# Altium schematic sheet PM3_Bosclone_PWR_0.SchDoc
size 282 x 200 mm
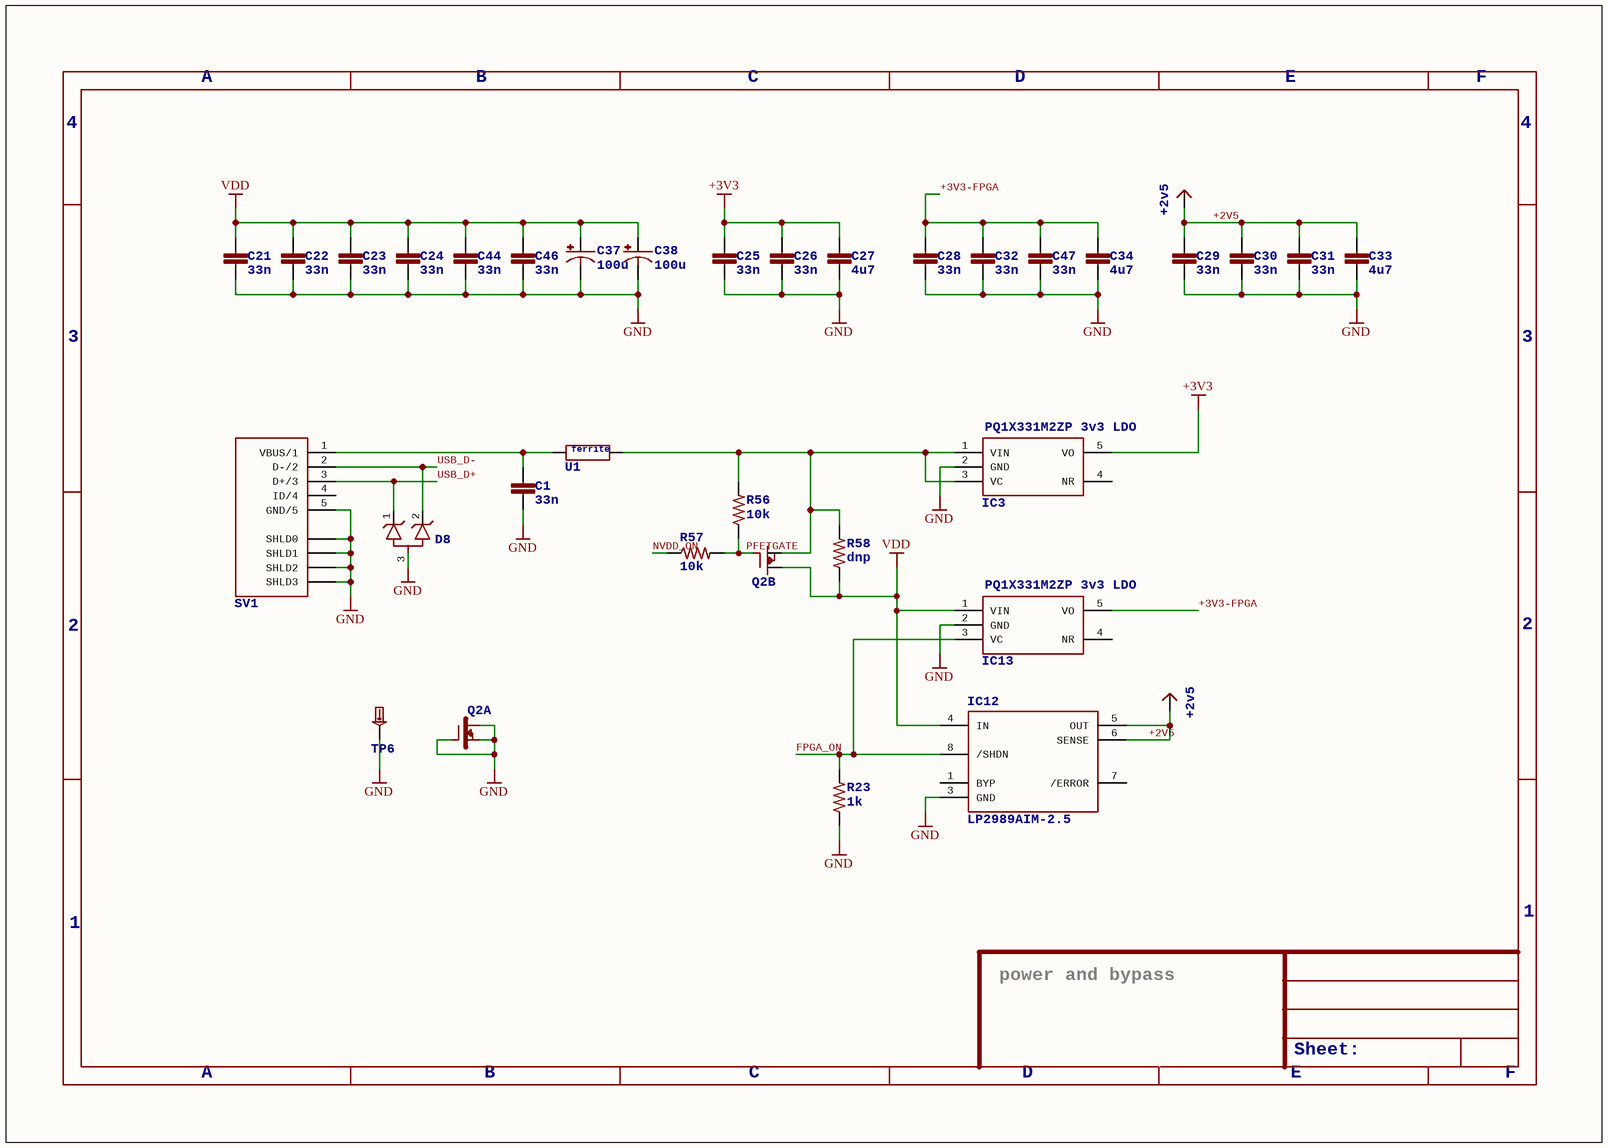
[diagram p0: PM3_Bosclone_PWR_0.SchDoc]

## Parts
C1  33n  [RLC_0603]
C21  33n  [RLC_0603]
C22  33n  [RLC_0603]
C23  33n  [RLC_0603]
C24  33n  [RLC_0603]
C25  33n  [RLC_0603]
C26  33n  [RLC_0603]
C27  4u7  [RLC_1210]
C28  33n  [RLC_0603]
C29  33n  [RLC_0603]
C30  33n  [RLC_0603]
C31  33n  [RLC_0603]
C32  33n  [RLC_0603]
C33  4u7  [RLC_1210]
C34  4u7  [RLC_1210]
C37  100u  [CAPCAITOR-ELECTROLYTIC-ALCHIP-MZA-F80]
C38  100u  [CAPCAITOR-ELECTROLYTIC-ALCHIP-MZA-F80]
C44  33n  [RLC_0603]
C46  33n  [RLC_0603]
C47  33n  [RLC_0603]
D8  DUAL-TVS-COMMON-ANODE  [SOT23-3LEAD]  (value not drawn)
IC3  PQ1X331M2ZP3v3LDO: PQ1X331M2ZP 3v3 LDO  [SOT-23-5]  (hidden comment: PQ1X331M2ZP-3V3-LDO-SOT-23-5)
IC12  LP2989AIM-2.5  [SOIC-8]
IC13  PQ1X331M2ZP3v3LDO: PQ1X331M2ZP 3v3 LDO  [SOT-23-5]  (hidden comment: PQ1X331M2ZP-3V3-LDO-SOT-23-5)
Q2  IRF7307  [SOIC-8]  (value not drawn)  (parts A,B of 2)
R23  1k  [RLC_0603]
R56  10k  [RLC_0603]
R57  10k  [RLC_0603]
R58  dnp  [RLC_0603]
SV1  USB-MINIB  [USB-MINIB-SMD]  (value not drawn)
TP6  TESTPADKEYSTONE-PTH  [KEYSTONE-PTH-TESTPOINT-5011]  (value not drawn)
U1  FERRITE0805  [RLC_0805]  (value not drawn)
V31  SUPPLY_2V5  (value not drawn)
V37  SUPPLY_2V5  (value not drawn)

## Nets
+3V3: C25.1 C26.1 C27.1 IC3.5(VO)
GND: C1.2 C21.2 C22.2 C23.2 C24.2 C25.2 C26.2 C27.2 C28.2 C29.2 C30.2 C31.2 C32.2 C33.2 C34.2 C37.- C38.- C44.2 C46.2 C47.2 D8.3(A) IC3.2(GND) IC12.3(GND) IC13.2(GND) Q2.1(S) Q2.2(G) Q2.8(D) R23.1 SV1.5(GND/5) SV1.TAB0(SHLD0) SV1.TAB1(SHLD1) SV1.TAB2(SHLD2) SV1.TAB3(SHLD3) TP6.A(P$1)
VDD: C21.1 C22.1 C23.1 C24.1 C37.+ C38.+ C44.1 C46.1 IC12.4(IN) IC13.1(VIN) Q2.6(D) R58.1
+2V5: C29.1 C30.1 C31.1 C33.1 IC12.5(OUT) IC12.6(SENSE) V31.?1(+2V5) V37.?1(+2V5)
+3V3-FPGA: C28.1 C32.1 C34.1 C47.1 IC13.5(VO)
FPGA_ON: IC12.8(/SHDN) IC13.3(VC) R23.2
NVDD_ON: R57.1
PFETGATE: Q2.4(G) R56.1 R57.2
USB_D+: D8.1(K1) SV1.3(D+/3)
USB_D-: D8.2(K2) SV1.2(D-/2)
NetC1_1: C1.1 SV1.1(VBUS/1) U1.1(A)
NetIC3_1: IC3.1(VIN) IC3.3(VC) Q2.3(S) R56.2 R58.2 U1.2(B)

Not connected (* = marked no-connect by the designer): IC3 4(NR); IC12 1(BYP) 7(/ERROR); IC13 4(NR); SV1 4(ID/4)

## Notes on the sheet
- A
- B
- C
- D
- E
- F
- 4
- 3
- 2
- 1
- power and bypass
- Sheet:

## Library data of the parts
C1 C21-C26 C28-C32 C44 C46 C47 = CAPACITOR0603
C27 C33 C34 = CAPACITOR1210
C37 C38 = CAPACITOR-POLARIZEDALCHIP-MZA-F80
IC12 = LP2989-LDOSOIC
R23 R56-R58 = RESISTOR0603
U1 = FERRITE0805: ferrite: ferrite
V31 V37 = SUPPLY_2V5: +2v5: +2v5